# EAGLE schematic test (EAGLE 7.4.0)
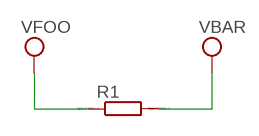
[diagram p0: schematic, sheet 1]

## Parts
R1  R  [R0805]

## Nets
VPP: R1.1 R1.2 ; supply symbol labelled VFOO, VBAR

## Library data of the parts
R1 = eagle-ltspice:R: RESISTOR, European symbol; SPICEMODEL: NONE; SPICEPREFIX: R